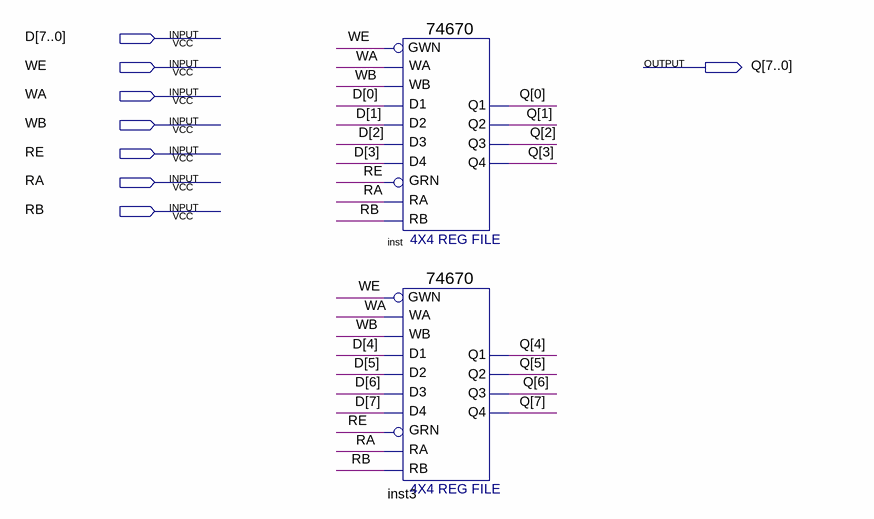
[diagram p0: schematic sheet]
// Quartus schematic 74670_8.bdf as structural Verilog: 2 symbols, 8 pins
module \74670_8  (
  input  [7:0] D,
  input  WE,
  input  WA,
  input  WB,
  input  RE,
  input  RA,
  input  RB,
  output [7:0] Q
);

  \74670  inst (
    .WA(WA), .D1(D[0]), .WB(WB), .D2(D[1]), .GRN(RE), .D4(D[3]), .D3(D[2]), .RA(RA), .RB(RB), .GWN(WE),
    .Q3(Q[2]), .Q4(Q[3]), .Q1(Q[0]), .Q2(Q[1]));
  \74670  inst3 (
    .WA(WA), .D1(D[4]), .WB(WB), .D2(D[5]), .GRN(RE), .D4(D[7]), .D3(D[6]), .RA(RA), .RB(RB), .GWN(WE),
    .Q3(Q[6]), .Q4(Q[7]), .Q1(Q[4]), .Q2(Q[5]));
endmodule
